# EAGLE design Qwiic_Iridium_9603N (EAGLE 9.5.2)
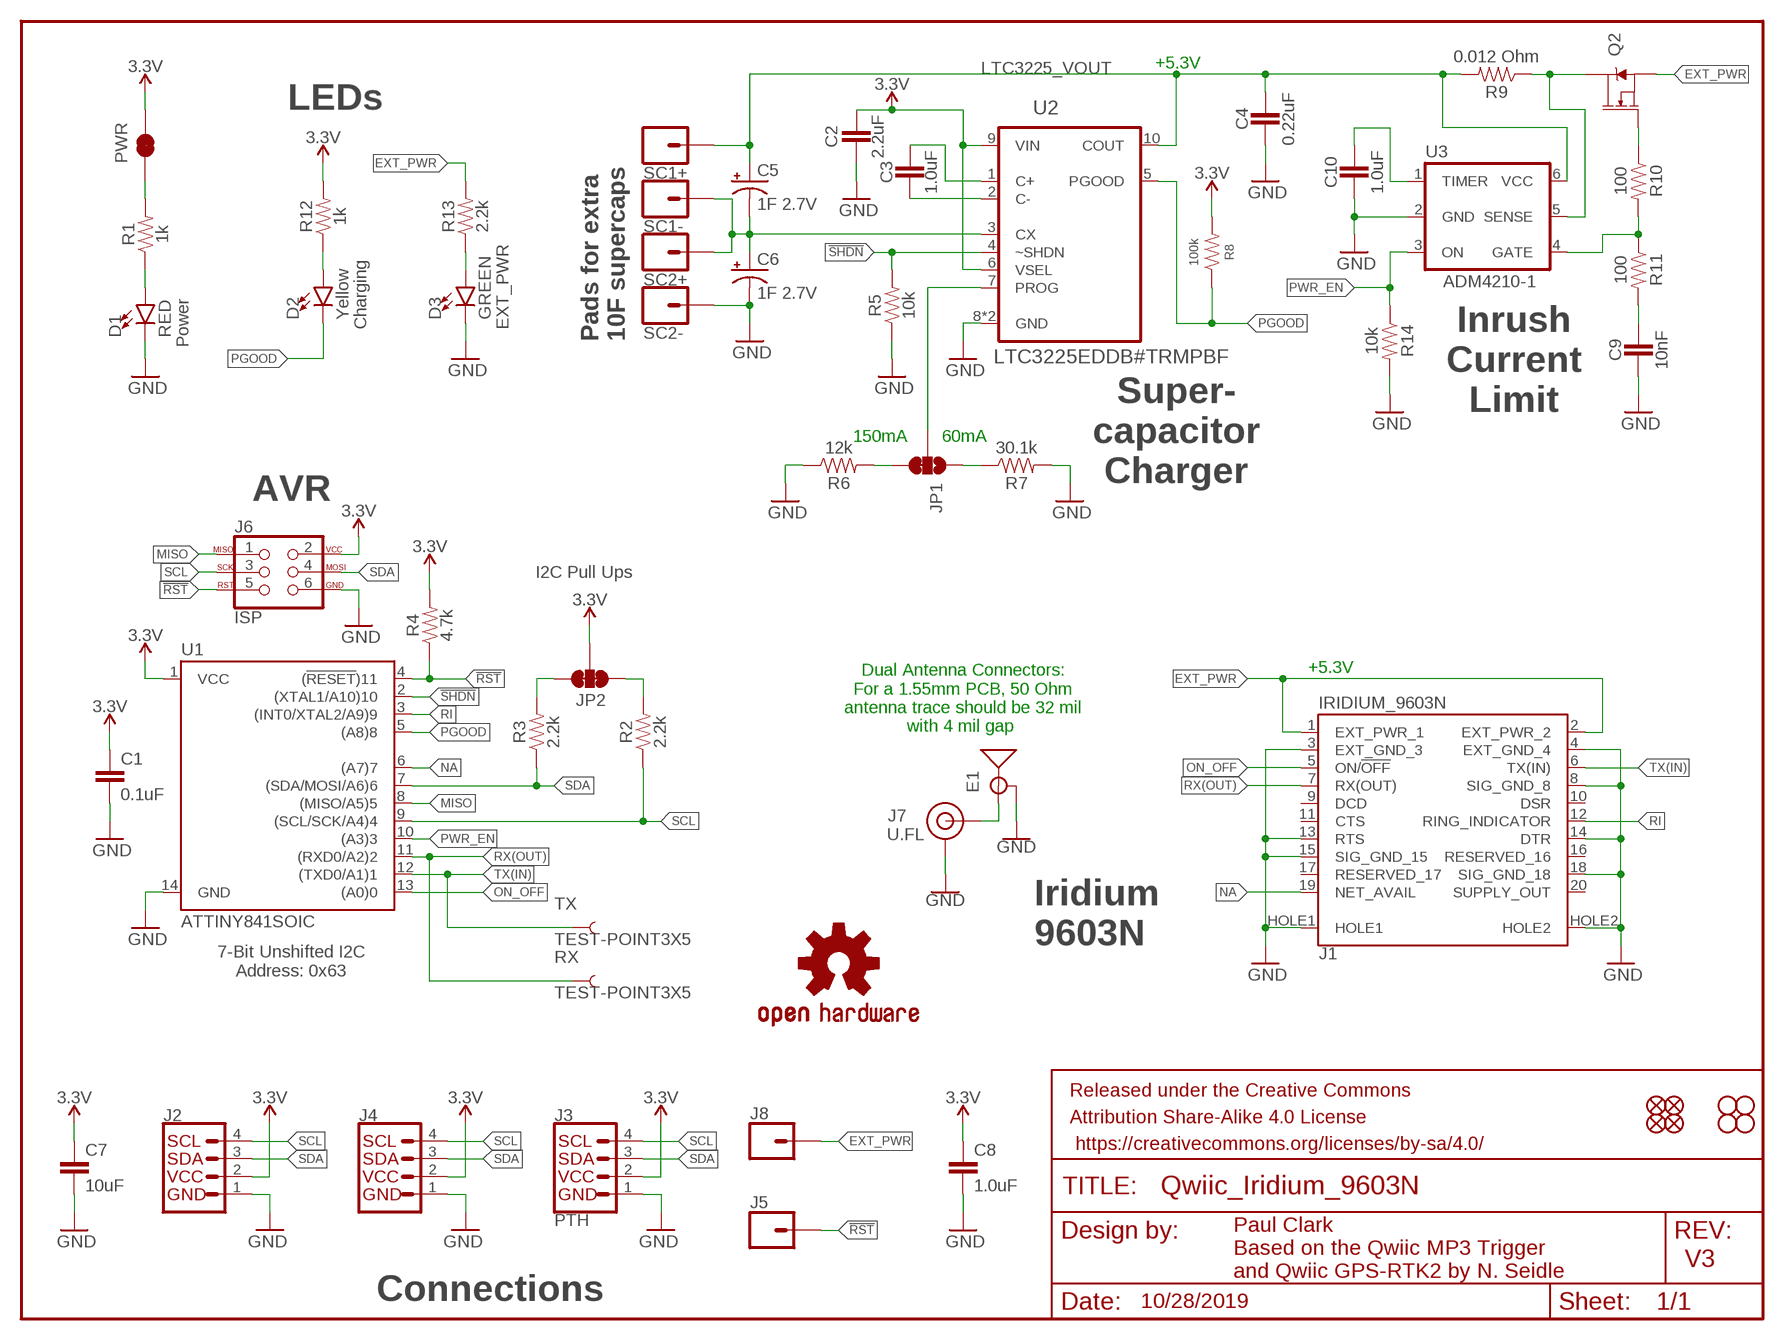
[diagram p0: schematic, sheet 1]

## Parts
C1  0.1uF  0.1UF-0603-25V-5%  [0603]
C2  2.2uF  2.2UF-0603-10V-20%  [0603]
C3  1.0uF  1.0UF-0603-16V-10%-X7R  [0603]
C4  0.22uF  0.22UF-0603-25V-10%  [0603]
C5  1F 2.7V  1F-2.7V(PTH)CPOL-RADIAL-1H-2.7V  [CPOL-RADIAL-1F-2.7V]
C6  1F 2.7V  1F-2.7V(PTH)CPOL-RADIAL-1H-2.7V  [CPOL-RADIAL-1F-2.7V]
C7  10uF  10UF-0603-6.3V-20%  [0603]
C8  1.0uF  1.0UF-0603-16V-10%-X7R  [0603]
C9  10nF  10NF-0603-50V-10%  [0603]
C10  1.0uF  1.0UF-0603-16V-10%-X7R  [0603]
D1  RED  LED-RED0603  [LED-0603]
D2  Yellow  LED-YELLOW0603  [LED-0603]
D3  GREEN  LED-GREEN0603  [LED-0603]
E1  ANTENNA-GROUNDEDEDGE_SMA  [SMA-EDGE]
FRAME1  FRAME-LETTER  [CREATIVE_COMMONS]
J1  IRIDIUM_9603N  [IRIDIUM_9603N]
J2  QWIIC_CONNECTORJS-1MM  [JST04_1MM_RA]
J3  PTH  I2C_STANDARD_NO_SILK  [1X04_NO_SILK]
J4  QWIIC_CONNECTORJS-1MM  [JST04_1MM_RA]
J5  CONN_01PTH_NO_SILK_YES_STOP  [1X01_NO_SILK]
J6  ISP  AVR_SPI_PROG_3X2TESTPOINTS  [2X3_TEST_POINTS]
J7  U.FL  U.FL2PIN  [U.FL]
J8  CONN_01PTH_NO_SILK_YES_STOP  [1X01_NO_SILK]
JP1  JUMPER-SMT_3_1-NC_TRACE_SILK  [SMT-JUMPER_3_1-NC_TRACE_SILK]
JP2  JUMPER-SMT_3_2-NC_TRACE_SILK  [SMT-JUMPER_3_2-NC_TRACE_SILK]
JP3  STAND-OFF  [STAND-OFF]
JP4  STAND-OFF  [STAND-OFF]
JP5  FIDUCIAL1X2  [FIDUCIAL-1X2]
JP6  FIDUCIAL1X2  [FIDUCIAL-1X2]
JP7  FIDUCIAL1X2  [FIDUCIAL-1X2]
JP8  FIDUCIAL1X2  [FIDUCIAL-1X2]
JP9  STAND-OFF  [STAND-OFF]
JP10  STAND-OFF  [STAND-OFF]
LOGO1  OSHW-LOGOMINI  [OSHW-LOGO-MINI]
PWR  JUMPER-SMT_2_NC_TRACE_SILK  [SMT-JUMPER_2_NC_TRACE_SILK]
Q2  5.8A/30V/35mΩ  MOSFET-NCH-AO3404A  [SOT23-3]
R1  1k  1KOHM-0603-1/10W-1%  [0603]
R2  2.2k  2.2KOHM-0603-1/10W-1%  [0603]
R3  2.2k  2.2KOHM-0603-1/10W-1%  [0603]
R4  4.7k  4.7KOHM-0603-1/10W-1%  [0603]
R5  10k  10KOHM-0603-1/10W-1%  [0603]
R6  12k  12KOHM-0603-1/10W-1%  [0603]
R7  30.1k  30.1KOHM-0603-1/10W-1%  [0603]
R8  100k  100KOHM-0603-1/10W-1%  [0603]
R9  0.012 Ohm  RESISTOR0603  [0603]
R10  100  100OHM-0603-1/10W-1%  [0603]
R11  100  100OHM-0603-1/10W-1%  [0603]
R12  1k  1KOHM-0603-1/10W-1%  [0603]
R13  2.2k  2.2KOHM-0603-1/10W-1%  [0603]
R14  10k  10KOHM-0603-1/10W-1%  [0603]
RX  TEST-POINT3X5  [PAD.03X.05]
SC1+  CONN_01PTH_NO_SILK_YES_STOP  [1X01_NO_SILK]
SC1-  CONN_01PTH_NO_SILK_YES_STOP  [1X01_NO_SILK]
SC2+  CONN_01PTH_NO_SILK_YES_STOP  [1X01_NO_SILK]
SC2-  CONN_01PTH_NO_SILK_YES_STOP  [1X01_NO_SILK]
TX  TEST-POINT3X5  [PAD.03X.05]
U1  ATTINY841SOIC  [ATTINY841]
U2  LTC3225EDDB#TRMPBF  LTC3225EDDB-TRMPBFDFN300X200-10L  [DFN300X200-10L]
U3  ADM4210-1  [TSOT6]

## Nets
3.3V [3.3V]: C1.1 C2.1 C7.1 C8.1 J2.2 J3.2(VCC) J4.2 J6.2 JP2.2 PWR.2 R4.2 R8.2 R12.2 U1.1(VCC) U2.6(VSEL) U2.9(VIN)
!RST: J5.1 J6.5 R4.1 U1.4((!RESET!)11)
!SHDN: R5.2 U1.2((XTAL1/A10)10) U2.4(~SHDN)
EXT_PWR: J1.1(EXT_PWR_1) J1.2(EXT_PWR_2) J8.1 Q2.2(S) R13.2
GND: C1.2 C2.2 C4.2 C6.- C7.2 C8.2 C9.2 C10.2 D1.C D3.C E1.GND@0(GND) E1.GND@1(GND) E1.GND@2(GND) E1.GND@3(GND) J1.3(EXT_GND_3) J1.4(EXT_GND_4) J1.8(SIG_GND_8) J1.13(RTS) J1.14(DTR) J1.15(SIG_GND_15) J1.18(SIG_GND_18) J1.HOLE1 J1.HOLE2 J2.1 J3.1(GND) J4.1 J6.6 J7.1(GND) J7.2(GND) R5.1 R6.1 R7.2 R14.2 SC2-.1 U1.14(GND) U2.8(GND) U2.11(GND) U3.2(GND)
LTC3225_VOUT: C4.1 C5.+ R9.2 SC1+.1 U2.10(COUT) U3.6(VCC)
MISO: J6.1 U1.8((MISO/A5)5)
N$1: C5.- C6.+ SC1-.1 SC2+.1 U2.3(CX)
N$2: JP1.3 R6.2
N$3: D1.A R1.1
N$4: JP1.1 R7.1
N$5: D2.A R12.1
N$6: D3.A R13.1
N$7: E1.SIG(SIGNAL) J7.FEED(SIGNAL)
N$8: Q2.3(D) R9.1 U3.5(SENSE)
N$9: C3.2 U2.2(C-)
N$10: C3.1 U2.1(C+)
N$11: JP1.2 U2.7(PROG)
N$12: Q2.1(G) R10.1
N$13: R10.2 R11.1 U3.4(GATE)
N$14: C9.1 R11.2
N$15: C10.1 U3.1(TIMER)
N$16: PWR.1 R1.2
NA: J1.19(NET_AVAIL) U1.6((A7)7)
ON_OFF: J1.5(ON/!OFF!) U1.13((A0)0)
PGOOD: D2.C R8.1 U1.5((A8)8) U2.5(PGOOD)
PWR_EN: R14.1 U1.10((A3)3) U3.3(ON)
RI: J1.12(RING_INDICATOR) U1.3((INT0/XTAL2/A9)9)
RX(OUT): J1.7(RX(OUT)) RX.P$1 U1.11((RXD0/A2)2)
SCL: J2.4 J3.4(SCL) J4.4 J6.3 R2.1 U1.9((SCL/SCK/A4)4)
SCL_PU1: JP2.1 R2.2
SDA: J2.3 J3.3(SDA) J4.3 J6.4 R3.1 U1.7((SDA/MOSI/A6)6)
SDA_PU1: JP2.3 R3.2
TX(IN): J1.6(TX(IN)) TX.P$1 U1.12((TXD0/A1)1)
Unconnected: J1.9(DCD) J1.10(DSR) J1.11(CTS) J1.16(RESERVED_16) J1.17(RESERVED_17) J1.20(SUPPLY_OUT)

## Notes on the sheet
- +5.3V
- LEDs
- Inrush
  Current
  Limit
- Charging | EXT_PWR
- Pads for extra
  10F supercaps
- Power
- 150mA | 60mA
- Super-
  capacitor
  Charger
- AVR
- I2C Pull Ups
- +5.3V
- Dual Antenna Connectors:
  For a 1.55mm PCB, 50 Ohm
  antenna trace should be 32 mil
  with 4 mil gap
- Iridium
  9603N
- 7-Bit Unshifted I2C
  Address: 0x63
- V3
- Paul Clark
  Based on the Qwiic MP3 Trigger
  and Qwiic GPS-RTK2 by N. Seidle
- Connections
- 10/28/2019

## Library data of the parts
C1 = SparkFun-Capacitors:0.1UF: 0.1µF ceramic capacitors A capacitor is a passive two-terminal electrical component used to store electrical energy temporarily in an electric field.; PROD_ID: CAP-08604
C2 = SparkFun-Capacitors:2.2UF: 2.2µF ceramic capacitors A capacitor is a passive two-terminal electrical component used to store electrical energy temporarily in an electric field.; PROD_ID: CAP-07888
C3 C8 C10 = SparkFun-Capacitors:1.0UF: 1µF ceramic capacitors A capacitor is a passive two-terminal electrical component used to store electrical energy temporarily in an electric field.; PROD_ID: CAP-13930
C4 = SparkFun-Capacitors:0.22UF: 0.22µF ceramic capacitors A capacitor is a passive two-terminal electrical component used to store electrical energy temporarily in an electric field.; PROD_ID: CAP-07822
C5 C6 = SparkFun-Capacitors:1F-2.7V(PTH): CAP-08070
C7 = SparkFun-Capacitors:10UF: 10.0µF ceramic capacitors A capacitor is a passive two-terminal electrical component used to store electrical energy temporarily in an electric field.; PROD_ID: CAP-11015
C9 = SparkFun-Capacitors:10NF: 0.01uF/10nF/10,000pF ceramic capacitors A capacitor is a passive two-terminal electrical component used to store electrical energy temporarily in an electric field. CAP-09321; PROD_ID: CAP-00867
D1 = SparkFun-LED:LED-RED: Red SMD LED Used in manufacturing of most products at SparkFun Packages: 0603 - SMD 0603 package [Product Link] <http://docs.avagotech.com/docs/AV02-0551EN> 0603 SMART - SMD 0603 SMART package ( more efficient and expensive)[Product Link] <http://www.osram-os.com/Graphics/XPic2/00077099_0.pdf> 1206 - SMD1206 package [Product Link] <https://www.sparkfun.com/datasheets/DevTools/LilyPad/Q150OVS4.pdff> SparkFun Products: Pro Mini 328 -5V <https://www.sparkfun.com/products/821> RedBoard <https://www.sparkfun.com/products/12757> IOIO-OTG <https://www.sparkfun.com/products/13613>; PROD_ID: DIO-00819
D2 = SparkFun-LED:LED-YELLOW: Yellow SMD LED Used in manufacturing several products at SparkFun. Packages: 0603 - SMD 0603 package[Product Link] <http://www.kingbrightusa.com/product.asp?catalog_name=LED&product_id=APT1608SYCK> 0603 -SMART - SMART SMD 0603 package (more efficient/more expensive) [Product Link] <http://www.osram-os.com/osram_os/en/products/product-catalog/led-light-emitting-diodes/smartled-0603/ly-l29k/index.jsp> LilyPad - SMD1206 package[Product Datasheet] <https://www.sparkfun.com/datasheets/DevTools/LilyPad/Q150YUS4.pdf> SparkFun Products: Blynk Board <https://www.sparkfun.com/products/13794> IOIO-OTG <https://www.sparkfun.com/products/13613> XBee Explorer Serial <https://www.sparkfun.com/products/13225>; PROD_ID: DIO-09003
D3 = SparkFun-LED:LED-GREEN: Green SMD LED Used in manufacturing of various products at SparkFun Packages: 0603 - SMD 0603 package [Product Link] <http://www.futureelectronics.com/en/technologies/semiconductors/optoelectronics/leds/Pages/9894312-LTST-C190GKT.aspx?CrossPart=HSMG-C190&IM=0> LilyPad 1206 - SMD1206 LilyPad package [Product Link] <http://www.futureelectronics.com/en/Technologies/Product.aspx?ProductID=IN150NGHARVATEKCORPORATION2049943&IM=0> 1206 - SMD1206 package [Product Link] <http://www.futureelectronics.com/en/technologies/semiconductors/optoelectronics/leds/Pages/8315665-LTST-C150KGKT.aspx?IM=0> 1206 Bottom Mount -SMD 1206 Bottom Mount [Product Link] <http://www.digikey.com/product-detail/en/lite-on-inc/LTST-C230KGKT/160-1456-1-ND/386854> SparkFun Products: Pro Mini 328 -5V <https://www.sparkfun.com/products/821> RedBoard <https://www.sparkfun.com/products/12757> MP3 Trigger <https://www.sparkfun.com/products/13720> Makey Makey <https://www.sparkfun.com/products/11076>; PROD_ID: DIO-00821
E1 = SparkFun-RF:ANTENNA-GROUNDED: Antenna w/ Ground Connection 2.4GHz antennae with signal and ground terminals. TRACE_ANTENNA_2.4GHZ_15.2MM - Meander Trace antenna 15.2 x 5.7mm footprint Based on layout from TI app note AN043 <http://www.ti.com/lit/an/swra117d/swra117d.pdf>. TRACE_ANTENNA_2.4GHZ_25.7MM - Inverted F trace antenna 25.7 x 7.5 mm footprint. Based on layout from TI design note DN0007 <http://www.ti.com/lit/an/swru120b/swru120b.pdf>.; PROD_ID: CONN-08289
FRAME1 = SparkFun-Aesthetics:FRAME-LETTER: Schematic Frame - Letter Standard 8.5x11 US Letter frame
J1 = Qwiic_Iridium_9603N:IRIDIUM_9603N: Iridium 9603N with two McMaster 95117A411 press-fit nuts
J2 J4 = SparkFun-Connectors:QWIIC_CONNECTOR: SparkFun I2C Standard Qwiic Connector An SMD 1mm pitch JST connector makes it easy and quick (get it? Qwiic?) to connect I2C devices to each other. The Qwiic system <http://www.sparkfun.com/qwiic> enables fast and solderless connection between popular platforms and various sensors and actuators. We carry 200mm <https://www.sparkfun.com/products/14204>, 100mm <https://www.sparkfun.com/products/14205>, 50mm <https://www.sparkfun.com/products/14206>, and breadboard friendly <https://www.sparkfun.com/products/14207> Qwiic cables. We also offer 10 pcs strips <https://www.sparkfun.com/products/14323> the SMD connectors.; PROD_ID: CONN-13694; VALUE: QWIIC_RIGHT_ANGLE
J3 = SparkX:I2C_STANDARD: SparkFun I2C Standard Pinout Header SparkFun has standardized on a pinout for all I2C based sensor breakouts. This pinout allows I2C boards to be plugged directly into the headers on Arduino Uno compatible boards, and to be daisy chained easily. Example SparkFun Products: SparkFun Atmospheric Sensor Breakout - BME280 <https://www.sparkfun.com/products/13676> SparkFun Altitude/Pressure Sensor Breakout - MPL3115A2 <https://www.sparkfun.com/products/11084> SparkFun TOF Range Finder Sensor - VL6180 <https://www.sparkfun.com/products/12785>
J5 J8 SC1+ SC1- SC2+ SC2- = SparkFun-Connectors:CONN_01: Single connection point. Often used as Generic Header-pin footprint for 0.1 inch spaced/style header connections On any of the 0.1 inch spaced packages, you can populate with these: Break Away Headers - Straight <https://www.sparkfun.com/products/116> (PRT-00116) Break Away Male Headers - Right Angle <https://www.sparkfun.com/products/553> (PRT-00553) Female Headers <https://www.sparkfun.com/products/115> (PRT-00115) Break Away Headers - Machine Pin <https://www.sparkfun.com/products/117> (PRT-00117) Break Away Female Headers - Swiss Machine Pin <https://www.sparkfun.com/products/743> (PRT-00743) This device is also useful as a general connection point to wire up your design to another part of your project. Our various solder wires solder well into these plated through hole pads. Hook-Up Wire - Assortment (Stranded, 22 AWG) <https://www.sparkfun.com/products/11375> (PRT-11375) Hook-Up Wire - Assortment (Solid Core, 22 AWG) <https://www.sparkfun.com/products/11367> (PRT-11367) View the entire wire category on our website here <https://www.sparkfun.com/categories/141> Special notes: SMTSO-256-ET is a "flush mount" nut for a 4-40 screw. We mostly use this on specialty testbeds; it is a nice way to connect hardware to your PCB at an adjustable hieght. Also note, the SNAP packages are for using a snappable style connector. We sell a baggie of snaps and they are also used on two LilyPad designs: Snap Assortment - 30 pack (male and female) <https://www.sparkfun.com/products/11347> (DEV-11347) LilyPad Arduino SimpleSnap <https://www.sparkfun.com/products/10941> (DEV-10941) LilyPad SimpleSnap Protoboard <https://www.sparkfun.com/products/10940> (DEV-10940)
J6 = SparkFun-Connectors:AVR_SPI_PROG_3X2: AVR ISP 6 Pin This is the reduced ISP connector for AVR programming. Common on Arduino. This footprint will take up less PCB space and can be used with a 10-pin to 6-pin adapter such as SKU: BOB-08508 **Special note about "TEST_POINT" package. The stop mask is on the top side, so if you want your programming test points to be on the bottom of your board, make sure to place this package on the bottom side of the board. This also ensure that the orientation to program from the bottom side will be correct. SparkFun Products: SparkFun ISP Pogo Adapter <https://www.sparkfun.com/products/11591> - NS Tiny AVR Programmer <https://www.sparkfun.com/products/11801> -PTH
J7 = SparkFun-Connectors:U.FL2PIN: SMD Antenna Connector - U.FL 2mm height, 3.0mm x 3.0mm receptacle size. SparkFun Products: SparkFun WiFi Shield - ESP8266 <https://www.sparkfun.com/products/13287> SparkFun ESP8266 Thing <https://www.sparkfun.com/products/13231> SparkFun MiniGen - Pro Mini Signal Generator Shield <https://www.sparkfun.com/products/11420>; PROD_ID: CONN-09193; SF_ID: WRL-09144
JP1 = SparkFun-Jumpers:JUMPER-SMT_3_1-NC_TRACE: Normally closed trace jumper (1 of 2 connections) This jumper has a trace between two pads so it's normally closed (NC). The other connection is normally open (NO). Use a razor knife to open the connection. For best results follow the IPC guidelines for cutting traces: Cutout at least 0.063 mm (0.005 in). Remove all loose material to clean up the cut area. Seal the cut with an approved epoxy. Reapply solder to reclose the connection, or to close the NO connection.
JP2 = SparkFun-Jumpers:JUMPER-SMT_3_2-NC_TRACE: Normally closed trace jumper (2 of 2 connections) This jumper has a trace between all three pads so they are normally closed (NC). Use a razor knife to open the connection(s). For best results follow the IPC guidelines for cutting traces: Cutout at least 0.063 mm (0.005 in). Remove all loose material to clean up the cut area. Seal the cut with an approved epoxy. Reapply solder to reclose the connection(s).
JP3 JP4 JP9 JP10 = SparkFun-Hardware:STAND-OFF: Stand Off Drill holes for mechanically mounting via screws, standoffs, etc. Note: Use the keepout ring to avoid running the screw head into surrounding components. Variant Overviews STAND-OFF - Mechanical footprint for a #4 phillips button head screw. STAND-OFF-TIGHT - Mechanical footprint for a #4 phillips button head screw, Example SparkFun Products Screw - Phillips Head (1/4", 4-40, 10 pack) <https://www.sparkfun.com/products/10453> (PRT-10453) Screw - Phillips Head (1/2", 4-40, 10 pack) <https://www.sparkfun.com/products/10452> (PRT-10452) Screw - Phillips Head (3/4", 4-40, 10 pack) <https://www.sparkfun.com/products/10451> (PRT-10451) Screw - Phillips Head (1", 4-40, 10 pack) <https://www.sparkfun.com/products/10450> (PRT-10450)
JP5-JP8 = SparkFun-Aesthetics:FIDUCIAL: Fiducial Alignment Points Point-of-reference for pick-and-place machines and other optical instruments.
LOGO1 = SparkFun-Aesthetics:OSHW-LOGO: Open-Source Hardware (OSHW) Logo This logo indicates the piece of hardware it is found on incorporates a OSHW license and/or adheres to the definition of open source hardware found here: http://freedomdefined.org/OSHW
PWR = SparkFun-Jumpers:JUMPER-SMT_2_NC_TRACE: Normally closed trace jumper This jumper has a trace between two pads so it's normally closed (NC). Use a razor knife to open the connection. For best results follow the IPC guidelines for cutting traces: Cutout at least 0.063 mm (0.005 in). Remove all loose material to clean up the cut area. Seal the cut with an approved epoxy. Reapply solder to reclose the connection.
Q2 = SparkFun-DiscreteSemi:MOSFET-NCH: N-channel MOSFETs Voltage controlled devices that allow control of high current outputs. SparkFun Products: SparkFun OpenScale <https://www.sparkfun.com/products/13261> SparkFun Digital Sandbox <https://www.sparkfun.com/products/12651> SparkFun Monster Moto Shield <https://www.sparkfun.com/products/10182> SparkFun MOSFET Power Controller <https://www.sparkfun.com/products/11214>; PROD_ID: TRANS-12988
R1 R12 = Qwiic_Iridium_9603N:1KOHM: 1kΩ resistor A resistor is a passive two-terminal electrical component that implements electrical resistance as a circuit element. Resistors act to reduce current flow, and, at the same time, act to lower voltage levels within circuits. - Wikipedia; PROD_ID: RES-07856
R2 R3 R13 = SparkFun-Resistors:2.2KOHM: 2.2kΩ resistor A resistor is a passive two-terminal electrical component that implements electrical resistance as a circuit element. Resistors act to reduce current flow, and, at the same time, act to lower voltage levels within circuits. - Wikipedia; PROD_ID: RES-08272
R4 = SparkFun-Resistors:4.7KOHM: 4.7kΩ resistor A resistor is a passive two-terminal electrical component that implements electrical resistance as a circuit element. Resistors act to reduce current flow, and, at the same time, act to lower voltage levels within circuits. - Wikipedia; PROD_ID: RES-07857
R5 R14 = SparkFun-Resistors:10KOHM: 10kΩ resistor A resistor is a passive two-terminal electrical component that implements electrical resistance as a circuit element. Resistors act to reduce current flow, and, at the same time, act to lower voltage levels within circuits. - Wikipedia; PROD_ID: RES-00824
R6 = SparkFun-Resistors:12KOHM: 12kΩ resistor A resistor is a passive two-terminal electrical component that implements electrical resistance as a circuit element. Resistors act to reduce current flow, and, at the same time, act to lower voltage levels within circuits. - Wikipedia; PROD_ID: RES-10327
R7 = SparkFun-Resistors:30.1KOHM: 30.1kΩ resistor A resistor is a passive two-terminal electrical component that implements electrical resistance as a circuit element. Resistors act to reduce current flow, and, at the same time, act to lower voltage levels within circuits. - Wikipedia
R8 = SparkFun-Resistors:100KOHM: 100kΩ resistor A resistor is a passive two-terminal electrical component that implements electrical resistance as a circuit element. Resistors act to reduce current flow, and, at the same time, act to lower voltage levels within circuits. - Wikipedia; PROD_ID: RES-07828
R9 = SparkFun-Resistors:RESISTOR: Generic Resistor Package
R10 R11 = SparkFun-Resistors:100OHM: 100Ω resistor A resistor is a passive two-terminal electrical component that implements electrical resistance as a circuit element. Resistors act to reduce current flow, and, at the same time, act to lower voltage levels within circuits. - Wikipedia; PROD_ID: RES-07863
RX TX = SparkFun-Connectors:TEST-POINT: SparkFun Test Points Bare copper test points for troubleshooting or In-Circuit-Testing. These are used by our Production team for verifying production board runs using pogo-pins on test beds. SparkFun Products: SparkFun LSM9DS1 Breakout <https://www.sparkfun.com/products/13284> SparkFun PSOC <https://www.sparkfun.com/products/13714> SparkFun Load Cell Amplifier <https://www.sparkfun.com/products/13879>
U1 = Qwiic_Iridium_9603N:ATTINY841: The high-performance Microchip picoPower 8-bit AVR RISC-based microcontroller combines 8KB ISP flash memory, 512-Byte EEPROM, 512B SRAM, 12 general purpose I/O lines, 32 general purpose working registers, an 8-bit timer/counter with two PWM channels,??two 16-bit timer/counters with two PWM channels, internal and external interrupts, an 12-channel 10-bit A/D converter, 2 On-chip analog comparators, 2 full duplex USARTs with Start Frame wake up from power down, master/slave SPI serial interface, slave I2C serial interface, programmable gain stage (1x, 20x, and 100x) for 12 differential ADC channel pairs, programmable watchdog timer with internal oscillator, internal calibrated oscillator, and four software selectable power saving modes. The device operates between 1.7-5.5 volts.
U2 = Qwiic_Iridium_9603N:LTC3225EDDB-TRMPBF: 150mA Supercapacitor Charger
U3 = Qwiic_Iridium_9603N:ADM4210

## Net classes
1 3.3V: width 0.305 mm

## Board
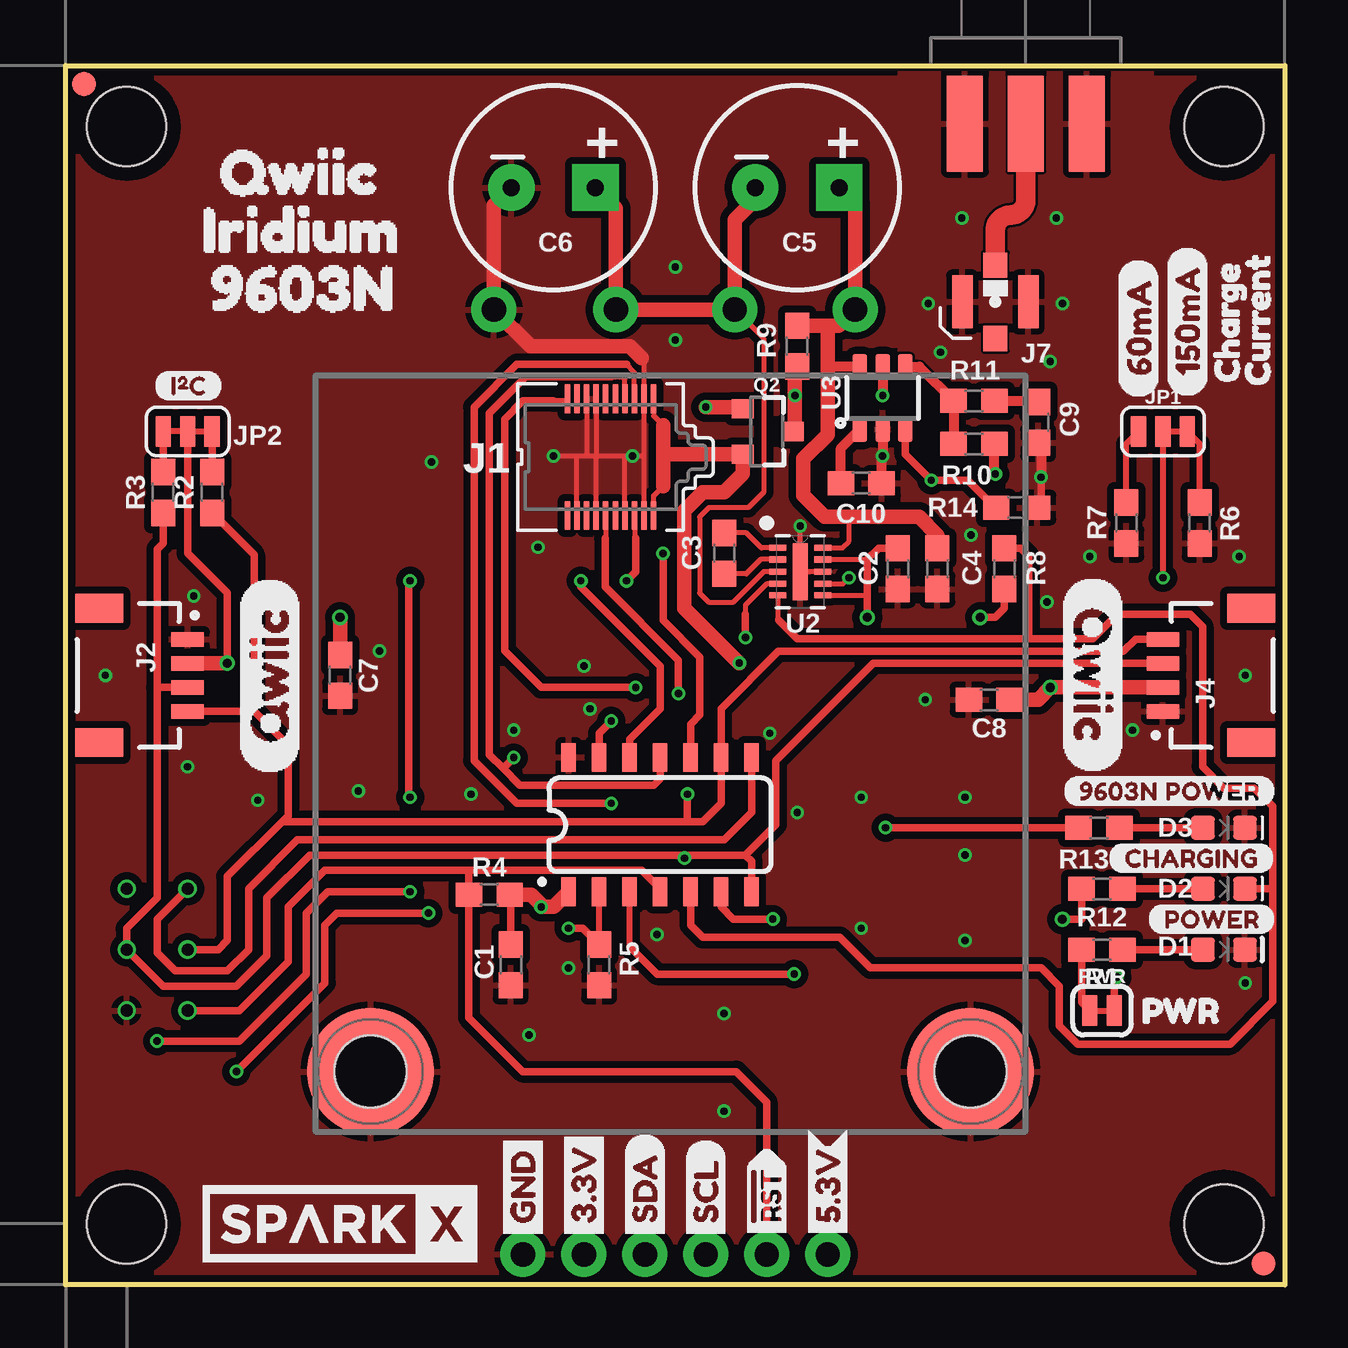
[diagram p1: board, top side]
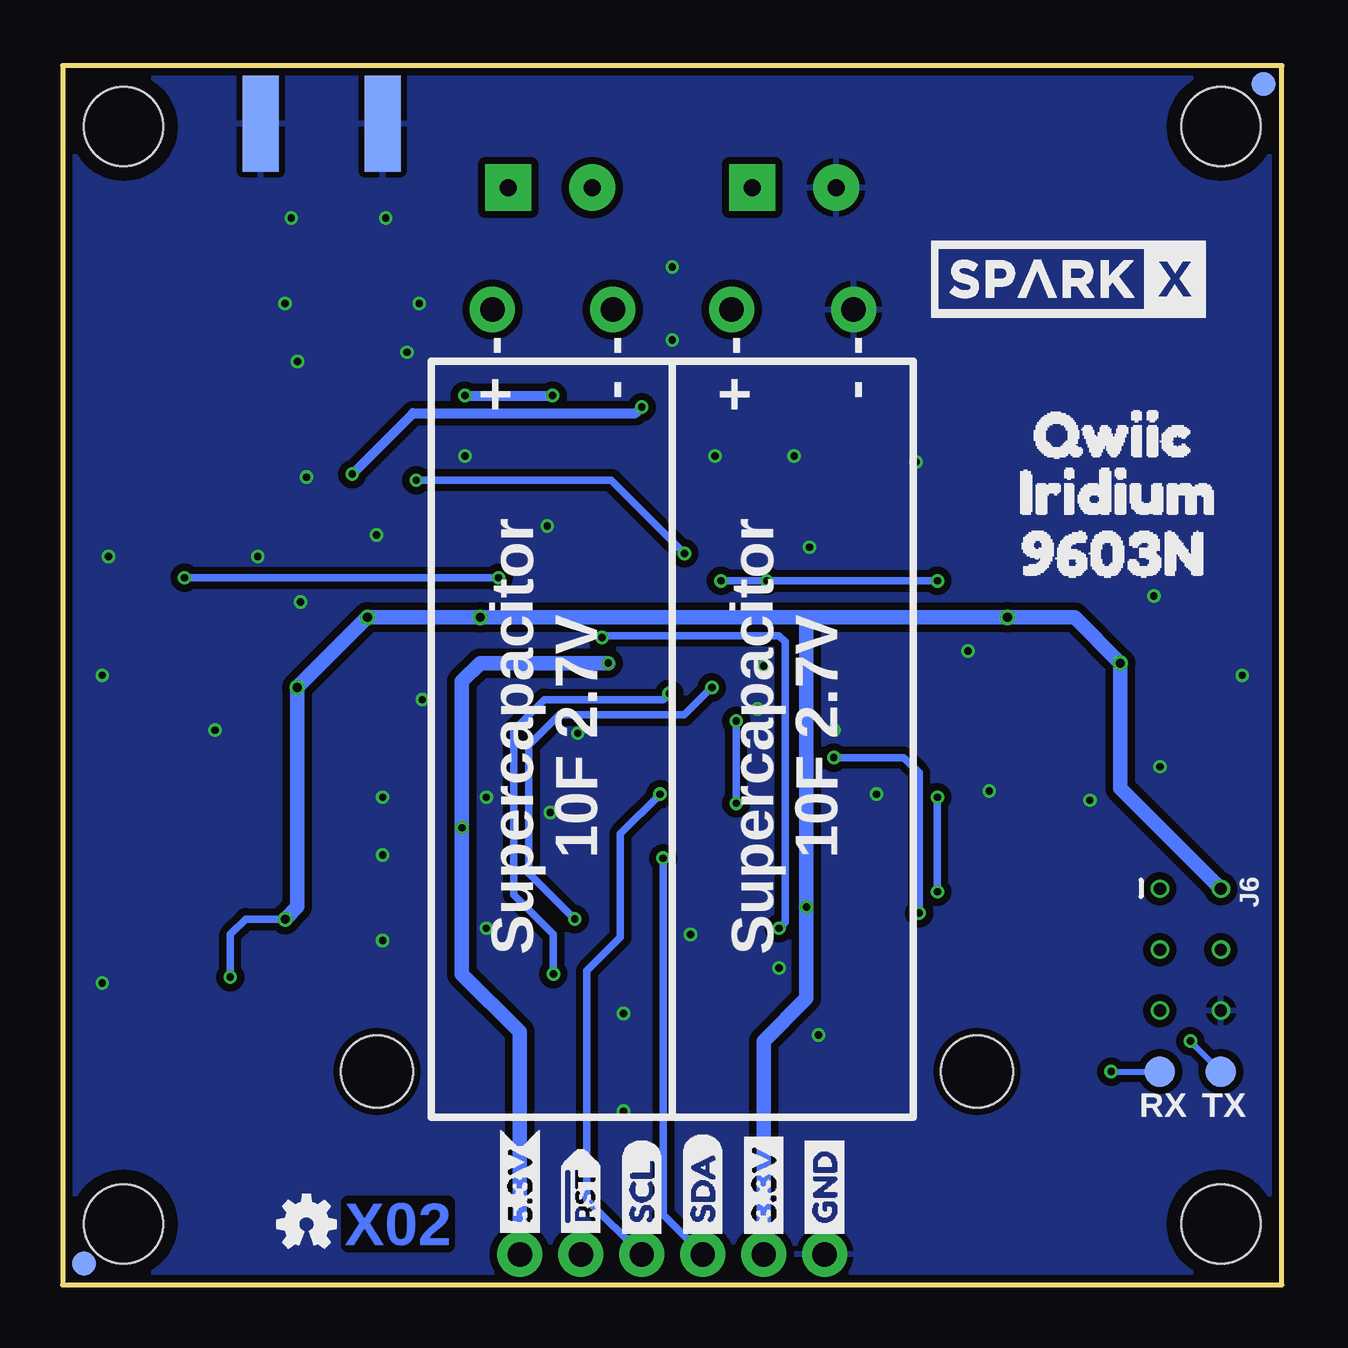
[diagram p2: board, bottom side, seen from below]

Size 50.8 x 50.8 mm. Coordinates in mm from the lower left corner, seen from the top.
Outline: 0,0 0,50.8 50.8,50.8 50.8,0 0,0
Copper layers (1*16): Top 0.035mm / dielectric 1.5mm / Bottom 0.035mm
Design rules "SparkFun-2-layer-FAB-LIMIT": minimum track width 4mil, minimum drill 6mil, track to track 4mil, track to pad 4mil, pad to pad 4mil, via to via 4mil, smd to smd 4mil, copper to edge 4mil, drill to drill 4mil, minimum pad ring 5mil, minimum via ring 5mil, stop-mask expansion 4mil, vias tented up to drill 25mil, thermal gap 10mil

### Footprints (pad centres in the part's own frame; a part is rotated, then mirrored left to right if it is on the bottom)
0603 = smd 1.1 x 1: 1 -0.85,0; 2 0.85,0
CPOL-RADIAL-1F-2.7V = drill 0.7 pad 1.93 square: + 1.75,0 | drill 0.7 pad 1.93: - -1.75,0
LED-0603 = smd 1 x 1: A -0.877,0; C 0.877,0
SMA-EDGE = smd 1.5 x 4: GND@0 -2.54,0; GND@1 2.54,0; SIG 0,0 | smd 1.5 x 4 bottom: GND@2 -2.54,0; GND@3 2.54,0
IRIDIUM_9603N = smd 0.23 x 1.2: 1 11.8,28.035; 2 11.8,23.165; 3 11.4,28.035; 4 11.4,23.165; 5 11,28.035; 6 11,23.165; 7 10.6,28.035; 8 10.6,23.165; 9 10.2,28.035; 10 10.2,23.165; 11 9.8,28.035; 12 9.8,23.165; 13 9.4,28.035; 14 9.4,23.165; 15 9,28.035; 16 9,23.165; 17 8.6,28.035; 18 8.6,23.165; 19 8.2,28.035; 20 8.2,23.165 | smd 5.3 x 5.3: HOLE1 0,0; HOLE2 25,0 | hole 3: 0,0; 25,0
JST04_1MM_RA = smd 0.6 x 1.35: 1 -1.5,0; 2 -0.5,0; 3 0.5,0; 4 1.5,0 | smd 1.2 x 2: NC1 2.8,-3.675; NC2 -2.8,-3.675
1X04_NO_SILK = drill 1.016 pad 1.88: 1 0,0; 2 2.54,0; 3 5.08,0; 4 7.62,0
1X01_NO_SILK = drill 1.016 pad 1.88: 1 0,0
2X3_TEST_POINTS = drill 0.508: 1 -2.54,-1.27; 2 -2.54,1.27; 3 0,-1.27; 4 0,1.27; 5 2.54,-1.27; 6 2.54,1.27
U.FL = smd 2.2 x 0.85: 1 0,1.375; 2 0,-1.375 | smd 1.05 x 1: FEED 1.525,0; NC -1.525,0
SMT-JUMPER_3_1-NC_TRACE_SILK = smd 0.635 x 1.27: 1 -1.016,0; 2 0,0; 3 1.016,0
SMT-JUMPER_3_2-NC_TRACE_SILK = smd 0.635 x 1.27: 1 -1.016,0; 2 0,0; 3 1.016,0
STAND-OFF = hole 3.302: 0,0
FIDUCIAL-1X2 = smd 1 x 1: 1 0,0
SMT-JUMPER_2_NC_TRACE_SILK = smd 0.635 x 1.27: 1 -0.508,0; 2 0.508,0
SOT23-3 = smd 0.8 x 0.9: 1 -0.95,-1; 2 0.95,-1; 3 0,1.1
PAD.03X.05 = smd 1.27 x 1.27: P$1 0,0
ATTINY841 = smd 0.6 x 1.2: 1 -3.175,-2.8; 2 -1.905,-2.8; 3 -0.635,-2.8; 4 0.635,-2.8; 5 1.905,-2.8; 6 3.175,-2.8; 7 4.445,-2.8; 8 4.445,2.8; 9 3.175,2.8; 10 1.905,2.8; 11 0.635,2.8; 12 -0.635,2.8; 13 -1.905,2.8; 14 -3.175,2.8
DFN300X200-10L = smd 0.711 x 0.254: 1 -0.94,0.991; 2 -0.94,0.508; 3 -0.94,0; 4 -0.94,-0.508; 5 -0.94,-0.991; 6 0.94,-0.991; 7 0.94,-0.508; 8 0.94,0; 9 0.94,0.508; 10 0.94,0.991 | smd 0.635 x 2.388: 11 0,0
TSOT6 = smd 0.6 x 1.05: 1 -0.95,-1.3; 2 0,-1.3; 3 0.95,-1.3; 4 0.95,1.3; 5 0,1.3; 6 -0.95,1.3

### Placement (x,y rotation side)
C1  18.54,13.34 270 top
C2  34.67,29.84 270 top
C3  27.43,30.48 270 top
C4  36.32,29.84 270 top
C5  30.48,45.72 0 top
C6  20.32,45.72 0 top
C7  11.43,25.4 270 top
C8  38.48,24.38 180 top
C9  40.51,35.94 270 top
C10  33.15,33.4 0 top
D1  48.26,13.97 0 top
D2  48.26,16.51 0 top
D3  48.26,19.05 0 top
E1  40.01,48.39 0 top
FRAME1  -7.62,-13.97 0 top  (outside the outline)
J1  12.7,8.89 0 top
J2  5.08,25.4 270 top
J3  19.05,1.27 0 top
J4  45.72,25.4 90 top
J5  29.21,1.27 0 top
J6  3.81,13.97 270 bottom
J7  38.73,40.96 90 top
J8  31.75,1.27 0 top
JP1  45.72,35.56 0 top
JP2  5.08,35.56 180 top
JP3  2.54,48.26 0 top
JP4  48.26,48.26 0 top
JP5  49.91,0.89 0 bottom
JP6  0.76,50.04 0 top
JP7  0.76,50.04 0 bottom
JP8  49.91,0.89 0 top
JP9  48.26,2.54 0 top
JP10  2.54,2.54 0 top
LOGO1  40.64,2.54 0 bottom
PWR  43.18,11.43 0 top
Q2  29.21,35.56 270 top
R1  43.18,13.97 180 top
R2  6.1,33.02 90 top
R3  4.06,33.02 90 top
R4  17.65,16.26 0 top
R5  22.23,13.34 90 top
R6  47.24,31.75 90 top
R7  44.2,31.75 270 top
R8  39.12,29.84 270 top
R9  30.48,39.12 90 top
R10  37.85,35.05 180 top
R11  37.85,36.83 0 top
R12  43.18,16.51 180 top
R13  43.05,19.05 180 top
R14  39.62,32.38 0 top
RX  5.08,8.89 0 bottom
SC1+  32.89,40.64 0 top
SC1-  27.88,40.64 0 top
SC2+  22.92,40.64 0 top
SC2-  17.84,40.64 0 top
TX  2.54,8.89 0 bottom
U1  24.13,19.18 0 top
U2  30.61,29.72 0 top
U3  34.04,36.96 0 top
U$1  [60MA0]  44.7,36.96 90 top
U$2  [POWER0]  45.09,15.24 0 top
U$3  [GND1]  19.05,1.65 90 bottom
U$4  [3#3V2]  21.59,1.65 90 bottom
U$5  [SDA8]  24.13,1.65 90 bottom
U$6  [SCL9]  26.67,1.65 90 bottom
U$7  [RST#-[>]  29.21,1.52 90 top
U$8  [I_SUPER2_C-()-03]  3.68,37.47 0 top
U$9  [CHARGING0]  43.43,17.78 0 top
U$10  [9603N_POWER0]  41.53,20.57 0 top
U$11  [5#3V0]  31.75,1.65 90 bottom
U$12  [QWIIC0]  4.83,46.35 0 top
U$13  [150MA0]  46.74,36.96 90 top
U$14  [CHARGE0]  48.39,36.7 90 top
U$15  [CURRENT0]  49.66,36.58 90 top
U$16  [RST#-[>]  29.21,1.52 90 bottom
U$17  [QWIIC0]  11.94,35.43 0 bottom
U$18  [IRIDIUM0]  4.06,43.94 0 top
U$19  [IRIDIUM0]  12.57,33.02 0 bottom
U$20  [9603N0]  4.45,41.53 0 top
U$21  [3#3V2]  21.59,1.65 90 top
U$22  [GND1]  19.05,1.65 90 top
U$23  [QWIIC0]  8.51,21.21 90 top
U$24  [9603N0]  12.45,30.48 0 bottom
U$25  [QWIIC0]  42.8,29.59 270 top
U$26  [SCL9]  26.67,1.65 90 top
U$27  [SDA8]  24.13,1.65 90 top
U$29  [SPARKX-LARGE]  8.89,41.91 0 bottom
U$30  [SPARKX-LARGE]  11.43,2.54 0 top
U$31  [_PWR1]  43.56,11.43 0 top
U$32  [5#3V0]  31.75,1.65 90 top

### Tracks (layer width: path | path; a pad name or v marks a point on that pad's centre or on a via)
3.3V  (via drill 0.3, 0.38)
  Top 0.203: U2.9 33.4,30.23 | U2.6 33.38,28.73
  Top 0.305: C1.1 18.54,16.22 R4.2 | JP2.2 5.08,30.48 6.72,28.84 v6.72,25.9 | C2.1 33.87,30.7 33.4,30.23 33.4,28.7 | 33.4,28.7 v33.4,27.81 | 33.38,28.73 33.4,28.7 | R12.2 42.33,15.24 v41.53,15.24 | R8.2 39.12,28.19 38.73,27.81 v38.1,27.81 | PWR.2 43.69,12.7 v43.81,12.83
  Top 0.61: J2.2 v6.72,25.9 v6.73,25.91 | J4.2 v41.02,24.89 40.51,24.38 C8.1 | R4.2 19.39,16.26 19.81,15.84 v19.81,15.75 20.33,15.75 U1.1 | C7.1 v11.43,27.81
  Bottom 0.305: v43.81,12.83 43.81,14.61 43.18,15.24 v41.53,15.24
  Bottom 0.61: 19.81,27.81 v11.43,27.81 8.64,27.81 v6.73,25.91 6.73,20.7 J6.2 | 19.81,27.81 v33.4,27.81 v38.1,27.81 v41.02,24.89 41.02,15.75 v41.53,15.24 | 19.81,27.81 v19.81,15.75 19.81,11.94 21.59,10.16 J3.2
!RST
  Top 0.305: J6.5 7.24,11.43 9.27,13.46 9.27,15.75 10.79,17.27 16.8,17.27 | 16.8,17.27 R4.1 16.8,11.14 19.05,8.89 27.94,8.89 29.21,7.62 J5.1 | 16.8,17.27 24,17.27 24.77,16.51 U1.4
!SHDN  (via drill 0.3)
  Top 0.203: U2.4 29.21,29.21 28.32,28.32 28.32,27.94
  Top 0.254: R5.2 U1.2
  Top 0.305: R5.2 21.55,14.86 v20.95,14.86 | v28.32,26.98 28.32,27.94
  Bottom 0.305: v20.95,14.86 20.7,15.11 20.7,26.8 20.95,27.05 28.25,27.05 v28.32,26.98
EXT_PWR  (via drill 0.3)
  Top 0.203: 24.5,36.21 24.89,35.81 | 24.89,33.27 24.5,32.88 24.5,32.16 J1.2 | J1.1 24.5,36.21 | 24.5,36.21
  Top 0.305: v34.16,19.05 R13.2
  Top 0.61: 24.89,35.81 24.89,34.54 | 24.89,34.54 24.89,33.27 | v28.07,25.91 25.78,28.19 25.78,32.26 26.54,33.02 27.43,33.02 28.21,33.8 Q2.2 24.96,34.61 24.89,34.54
  Bottom 0.61: v28.07,25.91 33.4,25.91 34.16,25.15 v34.16,19.05 34.16,12.95 31.75,10.54 J8.1
GND  (via drill 0.3)
  Top 0.203: 24,38.61 24.1,38.51 J1.3 24.1,34.54 | J1.4 24.1,34.54 | 24.1,34.54 v23.62,34.54 23.37,34.54 | v20.32,34.54 21.34,34.54 | 21.34,34.54 21.72,34.54 | 21.72,34.54 22.1,34.54 | 22.1,34.54 23.37,34.54 | J1.15 21.7,34.56 21.72,34.54 | J1.13 22.1,34.55 22.1,34.54 | J1.18 21.3,34.51 21.34,34.54 | J1.14 22.1,34.54 | J1.8 23.3,34.48 23.37,34.54 | U2.8 U2.11 v30.61,31.62
  Top 0.305: R14.2 40.64,32.55 v40.64,33.66
  Top 0.406: U3.2 v34.04,34.54 34,34.51 C10.2 | C9.2 40.64,34.96 v40.64,33.66
  Top 0.61: C6.- 17.84,44.99 SC2-.1 19.37,39.12 23.5,39.12 24,38.61
  other vias: 20.95,13.21 27.43,11.3 5.08,21.59 5.33,28.7 1.65,25.4 42.67,30.35 48.9,30.35 44.45,23.11 37.47,17.91 18.67,23.11 21.84,24 16.89,20.45 37.34,44.45 41.27,44.45 41.53,40.89 25.4,39.37 21.59,25.78 19.68,30.73 15.24,34.29 8,20.19 33.15,20.32 33.15,14.86 27.43,7.24 19.3,10.41 49.15,25.4 40.89,28.45 12.19,20.57 35.94,40.89 25.4,42.42 13.08,26.42 35.81,24.38 24.64,14.61 29.34,22.99 30.48,19.68 36.45,38.86 41.02,38.48 37.47,20.32 37.47,14.35 37.72,31.24 49.15,12.57
  pour Bottom (isolate 0.305, rank 2): 0,0 0,50.8 50.8,50.8 50.8,0
  pour Top (isolate 0.305, rank 2): 0,0 0,50.8 50.8,50.8 50.8,0
  pour Top (isolate 0.102): 34.8,38.1 34.8,50.8 45.21,50.8 45.21,38.1
LTC3225_VOUT
  Top 0.203: U2.10 32.36,30.71 32.64,30.99 32.64,32
  Top 0.406: U3.6 31.78,38.26 31.75,38.23
  Top 0.61: C5.+ 32.89,45.06 SC1+.1 32.22,39.97 31.75,39.97 | C4.1 36.32,31.24 35.56,32 32.64,32 31.62,32 30.73,32.89 30.73,34.42 31.75,35.43 31.75,38.23 31.75,39.97 | 31.75,39.97 R9.2
MISO
  Top 0.305: J6.1 3.81,15.24 3.81,13.84 4.57,13.08 6.73,13.08 7.62,13.97 7.62,16.51 9.65,18.54 27.43,18.54 28.57,19.68 U1.8
N$1
  Top 0.203: U2.3 29.08,29.72 27.81,28.45 26.8,28.45 26.42,28.83 26.42,32 26.8,32.38 28.45,32.38 29.08,33.02 29.08,39.43 SC1-.1
  Top 0.61: C5.- 28.73,45.24 27.88,44.39 SC1-.1 SC2+.1 22.92,44.87 C6.+
N$2
  Top 0.254: R6.2 47.24,35.05 JP1.3
N$3
  Top 0.305: R1.1 D1.A
N$4
  Top 0.254: R7.1 44.2,35.05 JP1.1
N$5
  Top 0.305: R12.1 D2.A
N$6
  Top 0.305: R13.1 D3.A
N$7
  Top 0.813: J7.FEED 38.73,43.94 arc-90 39.37,44.58 arc90 40.01,45.21 E1.SIG
N$8  (via drill 0.3)
  Top 0.406: U3.5 v34.04,37.06 v34.04,37.05
  Top 0.61: R9.1 30.39,38.17 v30.39,37.05 30.39,35.64 Q2.3
  Bottom 0.406: v34.04,37.05 v30.39,37.05
N$9
  Top 0.203: U2.2 28.96,30.23 28.36,29.63 C3.2
N$10
  Top 0.203: U2.1 28.98,30.71 28.36,31.33 C3.1
N$11  (via drill 0.3)
  Top 0.203: U2.7 32.38,29.21 v32.64,29.46
  Top 0.254: JP1.2 v45.72,29.46
  Bottom 0.305: v45.72,29.46 v32.64,29.46
N$12  (via drill 0.3)
  Top 0.406: v38.73,33.78 38.7,33.82 R10.1
  Top 0.61: Q2.1 28.14,36.58 v26.67,36.58
  Bottom 0.406: v26.67,36.58 26.92,36.32 36.2,36.32 v38.73,33.78
N$13
  Top 0.406: U3.4 35.57,38.26 R11.1 R10.2
N$14
  Top 0.406: R11.2 40.47,36.83 C9.1
N$15
  Top 0.406: C10.1 32.3,34.87 U3.1
N$16
  Top 0.305: PWR.1 42.33,11.77 R1.2
NA  (via drill 0.3)
  Top 0.203: J1.19 20.8,36.83 20.32,36.83
  Top 0.254: 27.3,15.75 U1.6
  Top 0.305: v29.46,15.24 27.81,15.24 27.3,15.75 | 20.32,36.83 19.05,36.83 18.29,36.07 18.29,26.42 19.81,24.89 v23.75,24.89
  Bottom 0.305: v23.75,24.89 24.89,23.75 30.1,23.75 31.37,22.48 31.37,17.14 v29.46,15.24
ON_OFF  (via drill 0.3)
  Top 0.203: 23.37,38.35 23.7,38.02 23.7,36.83 J1.5
  Top 0.305: 23.37,38.35 18.8,38.35 17.02,36.58 17.02,21.84 18.8,20.07 v22.73,20.07 | v22.73,23.5 22.23,22.99 U1.13
  Bottom 0.305: v22.73,20.07 v22.73,23.5
PGOOD
  Top 0.203: U2.5 29.67,27.74 29.72,27.69
  Top 0.305: 29.72,27.69 30.48,26.92 40.13,26.92 | 40.13,26.92 42.8,26.92 43.81,27.94 46.86,27.94 47.37,27.43 47.37,21.59 48.26,20.7 49.53,20.7 50.29,19.94 50.29,16.51 | 50.29,16.51 50.29,11.81 48.51,10.03 42.16,10.03 41.4,10.79 41.4,12.45 40.64,13.21 33.53,13.21 32.26,14.48 26.54,14.48 26.04,14.99 U1.5 | D2.C 50.29,16.51 | R8.1 39.79,30.7 40.13,30.35 40.13,26.92
PWR_EN  (via drill 0.3)
  Top 0.305: v24.89,30.48 24.89,27.69 26.42,26.16 26.42,23.75 26.04,23.37 U1.10 | U3.3 34.99,34.61 v36.07,33.53 37.59,33.53 38.73,32.38 R14.1
  Bottom 0.305: v24.89,30.48 27.94,33.53 v36.07,33.53
RI  (via drill 0.3)
  Top 0.203: J1.12 22.5,31.14 22.48,31.11
  Top 0.254: 23.5,14.1 U1.3
  Top 0.305: 22.48,31.11 22.48,29.08 25.53,26.04 v25.53,24.64 | v30.35,12.95 24.64,12.95 23.5,14.1
  Bottom 0.305: v25.53,24.64 25.78,24.38 30.73,24.38 32,23.11 32,16.26 30.35,14.61 v30.35,12.95
RX(OUT)  (via drill 0.3)
  Top 0.203: 22.73,37.85 23.19,37.85 23.3,37.74 23.3,36.83 J1.7
  Top 0.305: 18.22,21.53 18.92,20.83 24.51,20.83 24.77,21.08 U1.11 | 18.22,21.53 17.65,22.1 17.65,36.32 19.18,37.85 22.73,37.85 | v15.11,15.49 11.3,15.49 10.79,14.99 10.79,12.57 v7.11,8.89 | v18.67,21.97 18.22,21.53
  Bottom 0.254: v7.11,8.89 RX.P$1
  Bottom 0.305: v15.11,15.49 15.11,21.34 15.75,21.97 v18.67,21.97
SCL  (via drill 0.3)
  Top 0.305: J6.3 6.35,13.97 6.73,14.35 6.73,17.02 9.02,19.3 | 25.91,19.3 26.54,19.3 27.3,20.07 U1.9 27.3,24 29.69,26.39 44.07,26.39 44.58,26.9 J4.4 | 25.91,19.3 9.02,19.3 | 9.02,19.3 9.27,19.56 9.27,22.48 7.85,23.9 | J2.4 7.85,23.9 | R2.1 7.85,30.42 7.85,23.9 | 25.91,19.3 v25.91,20.45
  Bottom 0.305: v25.91,20.45 27.56,18.8 27.56,14.48 28.96,13.08 28.96,3.56 J3.4
SCL_PU1
  Top 0.305: R2.2 JP2.1
SDA  (via drill 0.3)
  Top 0.305: 28.32,17.91 28.57,17.65 U1.7 | J4.3 33.65,25.9 29.59,21.84 29.59,19.18 28.32,17.91 | J2.3 3.82,24.9 | 3.82,24.9 3.81,24.89 3.81,16.13 2.54,14.86 J6.4 4.06,12.45 7.11,12.45 8.38,13.72 8.38,16.13 10.16,17.91 25.78,17.91 | R3.1 4.06,30.9 3.82,30.65 3.82,24.9 | 25.78,17.91 28.32,17.91 | 25.78,17.91 v25.78,17.78
  Bottom 0.305: v25.78,17.78 25.78,2.92 J3.3
SDA_PU1
  Top 0.305: JP2.3 R3.2
TX(IN)  (via drill 0.3)
  Top 0.203: J1.6 23.7,31.16 23.75,31.11
  Top 0.305: v23.37,29.34 23.75,29.72 23.75,31.11 | v21.46,29.34 21.46,29.08 24.77,25.78 24.77,24 23.5,22.73 U1.12 | v14.35,16.38 10.92,16.38 10.03,15.49 10.03,12.95 7.24,10.16 v3.81,10.16 | v14.35,20.32 14.3,20.37 14.3,29.29 v14.35,29.34
  Bottom 0.254: v3.81,10.16 TX.P$1
  Bottom 0.305: v23.37,29.34 v21.46,29.34 v14.35,29.34 | v14.35,16.38 v14.35,20.32

### Text on the board
Bottom: X02
tPlace: + | +
bPlace: - | - | - | - | - | - | + | + | Supercapacitor / 10F 2.7V | Supercapacitor / 10F 2.7V | TX | RX